# Altium project Lab5_electronics.PrjPcb
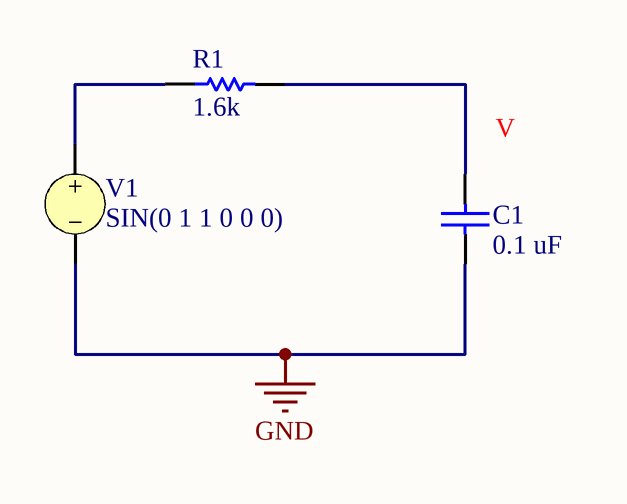
[diagram p0: Pasa_bajas.SchDoc]
4 sheets, 14 parts. Net scope: global (net labels, ports and power ports of the same name join across sheets).
Sheets:
  Pasa_bajas.SchDoc
  Pasa_altas.SchDoc
  Pasa_bandas.SchDoc
  Rechaza_bandas.SchDoc

## Sheet Pasa_bajas.SchDoc
size A; SheetNumber: 1; SheetTotal: 4

### Parts
C1  value 0.1 uF  (hidden comment: Capacitor)
R1  value 1.6k  (hidden comment: Resistor)
V1  SIN(0 1 1 0 0 0)

### Nets
GND: C1.1 V1.2
NetC1_2: C1.2 R1.2
NetR1_1: R1.1 V1.1

### Library data of the parts
C1 = Capacitor: SimulationGenericComponent: True
R1 = Resistor: TC1: 0; SimulationGenericComponent: True; TC2: 0
V1 = VSRC: Voltage Source; Note: PCB Footprint - Not required; AC Magnitude: 1; AC Phase: 0; Published: 8-Jun-2000; LatestRevisionDate: 17-Jul-2002; LatestRevisionNote: Re-released for DXP Platform.; PackageReference: Not Applicable; Publisher: Altium Limited; DC Magnitude: 1; Offset: 0; Amplitude: 1; Frequency: 1; Delay: 0; Damping Factor: 0; Phase: 0

## Sheet Pasa_altas.SchDoc
size A; SheetNumber: 2; SheetTotal: 4
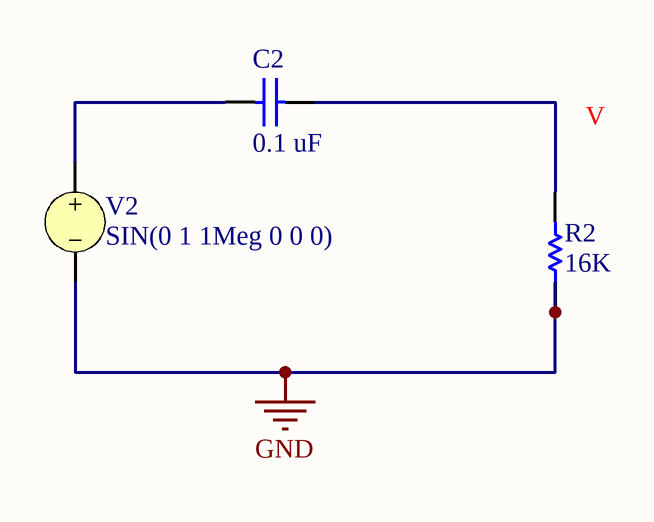
[diagram p1: Pasa_altas.SchDoc]

### Parts
C2  value 0.1 uF  (hidden comment: Capacitor)
R2  value 16K  (hidden comment: Resistor)
V2  SIN(0 1 1Meg 0 0 0)

### Nets
GND: R2.1 V2.2
NetC2_1: C2.1 V2.1
NetC2_2: C2.2 R2.2

### Library data of the parts
C2 = Capacitor: SimulationGenericComponent: True
R2 = Resistor: TC1: 0; SimulationGenericComponent: True; TC2: 0
V2 = VSRC: as V1 on sheet Pasa_bajas; Published: 8-Jun-2000; LatestRevisionDate: 17-Jul-2002; LatestRevisionNote: Re-released for DXP Platform.; PackageReference: Not Applicable; Publisher: Altium Limited; DC Magnitude: 1; Offset: 0; Amplitude: 1; Frequency: 1Meg; Delay: 0; Damping Factor: 0; Phase: 0

## Sheet Pasa_bandas.SchDoc
size A; SheetNumber: 3; SheetTotal: 4
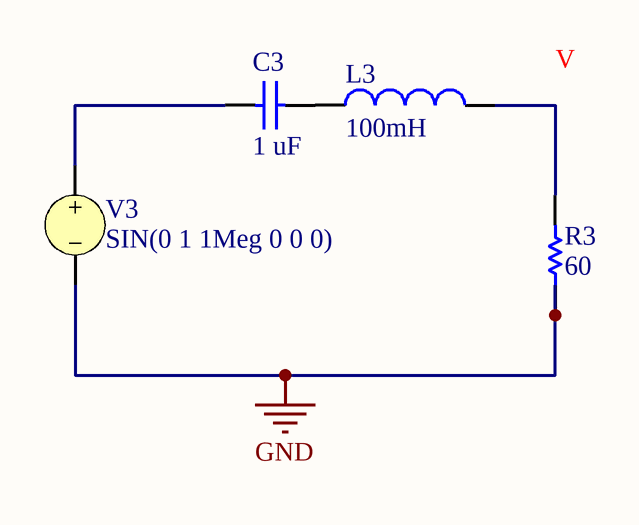
[diagram p2: Pasa_bandas.SchDoc]

### Parts
C3  value 1 uF  (hidden comment: Capacitor)
L3  value 100mH  (hidden comment: Inductor)
R3  value 60  (hidden comment: Resistor)
V3  SIN(0 1 1Meg 0 0 0)

### Nets
GND: R3.1 V3.2
NetC3_1: C3.1 V3.1
NetC3_2: C3.2 L3.1
NetL3_2: L3.2 R3.2

### Library data of the parts
C3 = Capacitor: SimulationGenericComponent: True
L3 = Inductor: SimulationGenericComponent: True
R3 = Resistor: TC1: 0; SimulationGenericComponent: True; TC2: 0
V3 = VSRC: as V1 on sheet Pasa_bajas; Published: 8-Jun-2000; LatestRevisionDate: 17-Jul-2002; LatestRevisionNote: Re-released for DXP Platform.; PackageReference: Not Applicable; Publisher: Altium Limited; DC Magnitude: 1; Offset: 0; Amplitude: 1; Frequency: 1Meg; Delay: 0; Damping Factor: 0; Phase: 0

## Sheet Rechaza_bandas.SchDoc
size A; SheetNumber: 4; SheetTotal: 4
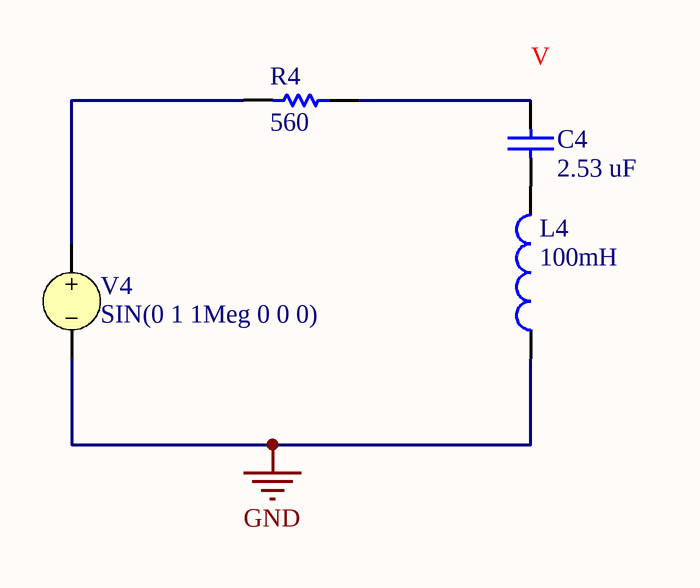
[diagram p3: Rechaza_bandas.SchDoc]

### Parts
C4  value 2.53 uF  (hidden comment: Capacitor)
L4  value 100mH  (hidden comment: Inductor)
R4  value 560  (hidden comment: Resistor)
V4  SIN(0 1 1Meg 0 0 0)

### Nets
GND: L4.1 V4.2
NetC4_1: C4.1 L4.2
NetC4_2: C4.2 R4.1
NetR4_2: R4.2 V4.1

### Library data of the parts
C4 = Capacitor: SimulationGenericComponent: True
L4 = Inductor: SimulationGenericComponent: True
R4 = Resistor: TC1: 0; SimulationGenericComponent: True; TC2: 0
V4 = VSRC: as V1 on sheet Pasa_bajas; Published: 8-Jun-2000; LatestRevisionDate: 17-Jul-2002; LatestRevisionNote: Re-released for DXP Platform.; PackageReference: Not Applicable; Publisher: Altium Limited; DC Magnitude: 1; Offset: 0; Amplitude: 1; Frequency: 1Meg; Delay: 0; Damping Factor: 0; Phase: 0

## Nets that join several sheets
GND: Pasa_bajas (C1.1 V1.2), Pasa_altas (R2.1 V2.2), Pasa_bandas (R3.1 V3.2), Rechaza_bandas (L4.1 V4.2)